# Altium schematic sheet PIC32MZ.SchDoc
size A3; SheetNumber: 1; SheetTotal: 6
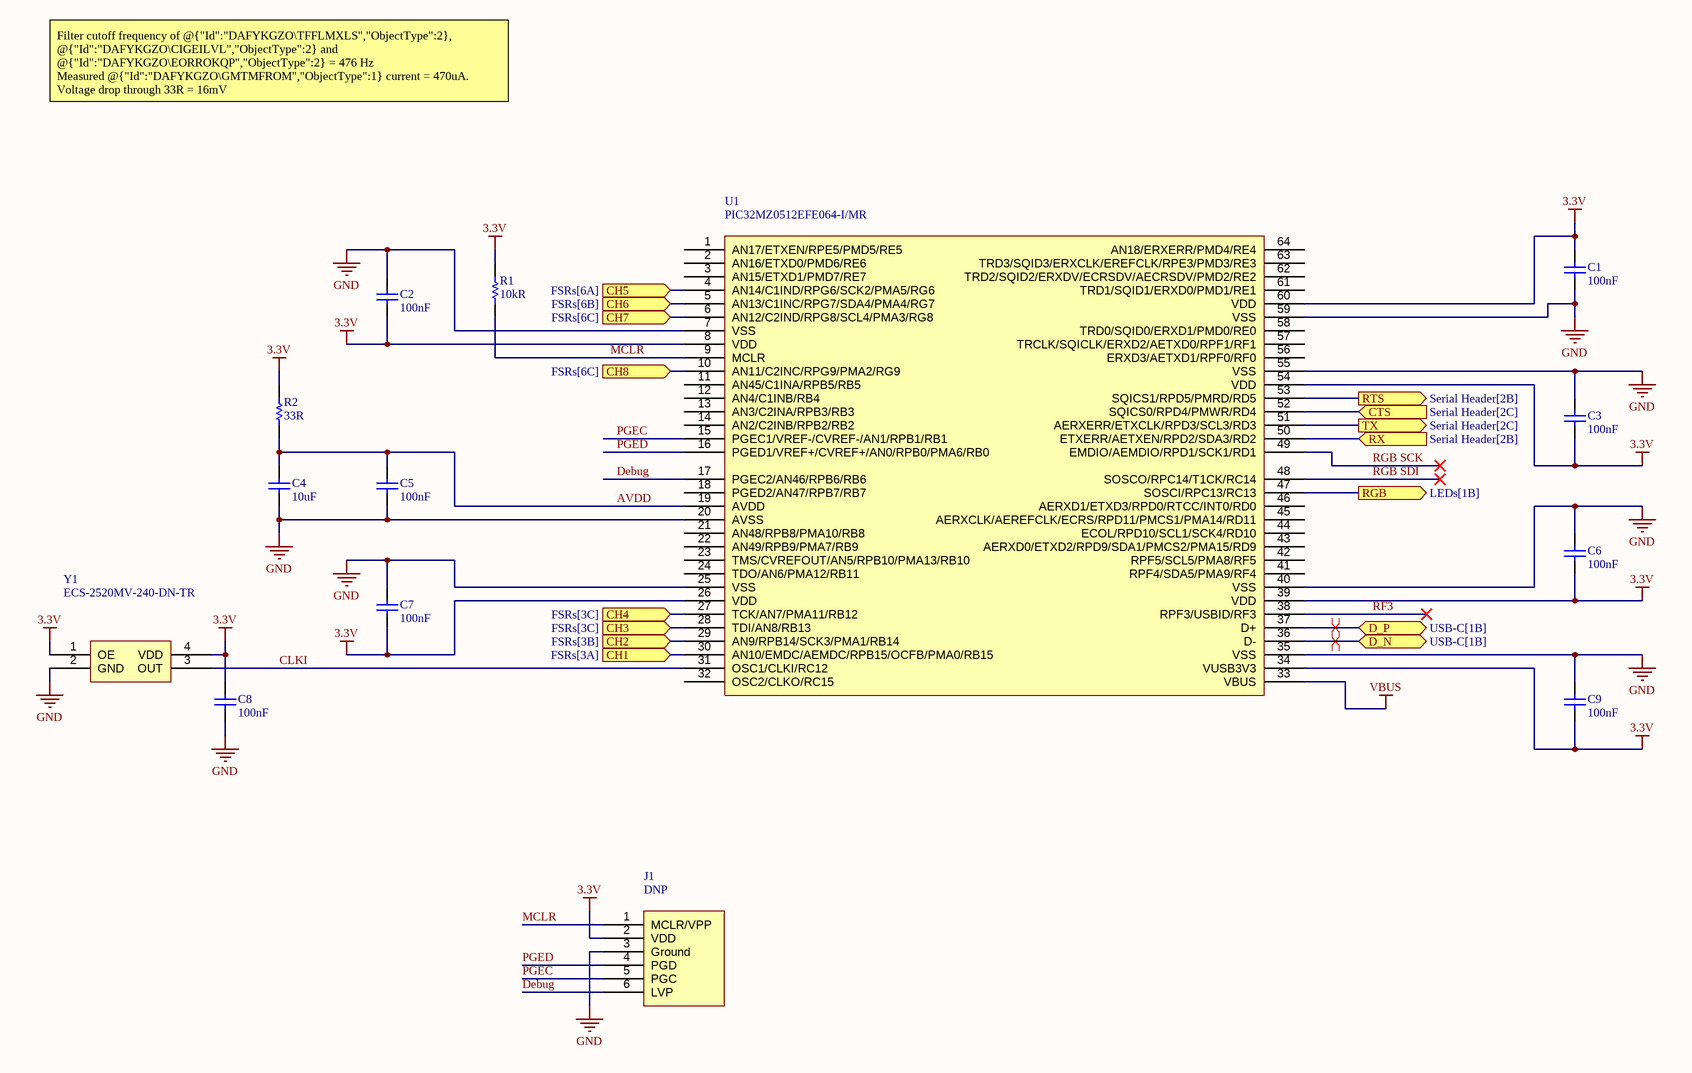
[diagram p0: PIC32MZ.SchDoc]

## Parts
C1  100nF  [Capacitor 0402]
C2  100nF  [Capacitor 0402]
C3  100nF  [Capacitor 0402]
C4  10uF  [Capacitor 0402]
C5  100nF  [Capacitor 0402]
C6  100nF  [Capacitor 0402]
C7  100nF  [Capacitor 0402]
C8  100nF  [Capacitor 0402]
C9  100nF  [Capacitor 0402]
J1  DNP  [Tag Connect No Legs]
R1  10kR  [Resistor 0402]
R2  33R  [Resistor 0402]
U1  PIC32MZ0512EFE064-I/MR  [QFN-64]
Y1  ECS-2520MV-240-DN-TR  [ECS 2x2.5mm]

## Ports
CH1 (in, see FSRs[3A]), CH2 (in, see FSRs[3B]), CH3 (in, see FSRs[3C]), CH4 (in, see FSRs[3C]), CH5 (in, see FSRs[6A]), CH6 (in, see FSRs[6B]), CH7 (in, see FSRs[6C]), CH8 (in, see FSRs[6C]), CTS (in, see Serial Header[2C]), D_N (bidir, see USB-C[1B]), D_P (bidir, see USB-C[1B]), RGB (out, see LEDs[1B]), RTS (out, see Serial Header[2B]), RX (in, see Serial Header[2B]), TX (out, see Serial Header[2C])

## Nets
3.3V: C1.2 C2.1 C3.1 C6.1 C7.1 C8.2 C9.1 J1.2(VDD) R1.2 R2.2 U1.8(VDD) U1.26(VDD) U1.34(VUSB3V3) U1.39(VDD) U1.54(VDD) U1.60(VDD) Y1.1(OE) Y1.4(VDD)
GND: C1.1 C2.2 C3.2 C4.1 C5.1 C6.2 C7.2 C8.1 C9.2 J1.3(Ground) U1.7(VSS) U1.20(AVSS) U1.25(VSS) U1.35(VSS) U1.40(VSS) U1.55(VSS) U1.59(VSS) Y1.2(GND)
VBUS: U1.33(VBUS)
AVDD: C4.2 C5.2 R2.1 U1.19(AVDD)
CH1: U1.30(AN10/EMDC/AEMDC/RPB15/OCFB/PMA0/RB15) ; port CH1
CH2: U1.29(AN9/RPB14/SCK3/PMA1/RB14) ; port CH2
CH3: U1.28(TDI/AN8/RB13) ; port CH3
CH4: U1.27(TCK/AN7/PMA11/RB12) ; port CH4
CH5: U1.4(AN14/C1IND/RPG6/SCK2/PMA5/RG6) ; port CH5
CH6: U1.5(AN13/C1INC/RPG7/SDA4/PMA4/RG7) ; port CH6
CH7: U1.6(AN12/C2IND/RPG8/SCL4/PMA3/RG8) ; port CH7
CH8: U1.10(AN11/C2INC/RPG9/PMA2/RG9) ; port CH8
CLKI: U1.31(OSC1/CLKI/RC12) Y1.3(OUT)
CTS: U1.52(SQICS0/RPD4/PMWR/RD4) ; port CTS
D_N: U1.36(D-) ; port D_N
D_P: U1.37(D+) ; port D_P
Debug: J1.6(LVP) U1.17(PGEC2/AN46/RPB6/RB6)
MCLR: J1.1(MCLR/VPP) R1.1 U1.9(MCLR)
PGEC: J1.5(PGC) U1.15(PGEC1/VREF-/CVREF-/AN1/RPB1/RB1)
PGED: J1.4(PGD) U1.16(PGED1/VREF+/CVREF+/AN0/RPB0/PMA6/RB0)
RF3: U1.38(RPF3/USBID/RF3)
RGB: U1.47(SOSCI/RPC13/RC13) ; port RGB
RGB SCK: U1.49(EMDIO/AEMDIO/RPD1/SCK1/RD1)
RGB SDI: U1.48(SOSCO/RPC14/T1CK/RC14)
RTS: U1.53(SQICS1/RPD5/PMRD/RD5) ; port RTS
RX: U1.50(ETXERR/AETXEN/RPD2/SDA3/RD2) ; port RX
TX: U1.51(AERXERR/ETXCLK/RPD3/SCL3/RD3) ; port TX

Not connected (* = marked no-connect by the designer): U1 1(AN17/ETXEN/RPE5/PMD5/RE5) 2(AN16/ETXD0/PMD6/RE6) 3(AN15/ETXD1/PMD7/RE7) 11(AN45/C1INA/RPB5/RB5) 12(AN4/C1INB/RB4) 13(AN3/C2INA/RPB3/RB3) 14(AN2/C2INB/RPB2/RB2) 18(PGED2/AN47/RPB7/RB7) 21(AN48/RPB8/PMA10/RB8) 22(AN49/RPB9/PMA7/RB9) 23(TMS/CVREFOUT/AN5/RPB10/PMA13/RB10) 24(TDO/AN6/PMA12/RB11) 32(OSC2/CLKO/RC15) 41(RPF4/SDA5/PMA9/RF4) 42(RPF5/SCL5/PMA8/RF5) 43(AERXD0/ETXD2/RPD9/SDA1/PMCS2/PMA15/RD9) 44(ECOL/RPD10/SCL1/SCK4/RD10) 45(AERXCLK/AEREFCLK/ECRS/RPD11/PMCS1/PMA14/RD11) 46(AERXD1/ETXD3/RPD0/RTCC/INT0/RD0) 56(ERXD3/AETXD1/RPF0/RF0) 57(TRCLK/SQICLK/ERXD2/AETXD0/RPF1/RF1) 58(TRD0/SQID0/ERXD1/PMD0/RE0) 61(TRD1/SQID1/ERXD0/PMD1/RE1) 62(TRD2/SQID2/ERXDV/ECRSDV/AECRSDV/PMD2/RE2) 63(TRD3/SQID3/ERXCLK/EREFCLK/RPE3/PMD3/RE3) 64(AN18/ERXERR/PMD4/RE4)

## Layout directives
differential pair: D_N, D_P

## Notes on the sheet
- Filter cutoff frequency of @{"Id":"DAFYKGZO\TFFLMXLS","ObjectType":2}, @{"Id":"DAFYKGZO\CIGEILVL","ObjectType":2} and @{"Id":"DAFYKGZO\EORROKQP","ObjectType":2} = 476 Hz
  Measured @{"Id":"DAFYKGZO\GMTMFROM","ObjectType":1} current = 470uA.  Voltage drop through 33R = 16mV
  @{"Id":"DAFYKGZO\FKAAGDIW","ObjectType":1} functionality may be compromised by USBID regardless of configuration.
  @{"Id":"DAFYKGZO\YGGPIFJJ","ObjectType":1} requires PIC32MZ internal pull-down to ensure @{"Id":"GGXARTPA\NNOJOWHS","ObjectType":1} is idle low.
  @{"Id":"DAFYKGZO\MQFSLGKT","ObjectType":1} will output SCK1 regardless of PPS configuration.
- TITLE
- SIZE
- A3
- VARIANT
- PROJECT
- SHEET
- VERSION
- OF
- AUTHOR
- DATE

## Library data of the parts
C1-C9 = Capacitor
J1 = MPLAB ICSP
R1 R2 = Resistor
U1 = PIC32MZ2048EFH064
Y1 = Oscillator